# EAGLE schematic lcd_helloworld (EAGLE 7.0.0)
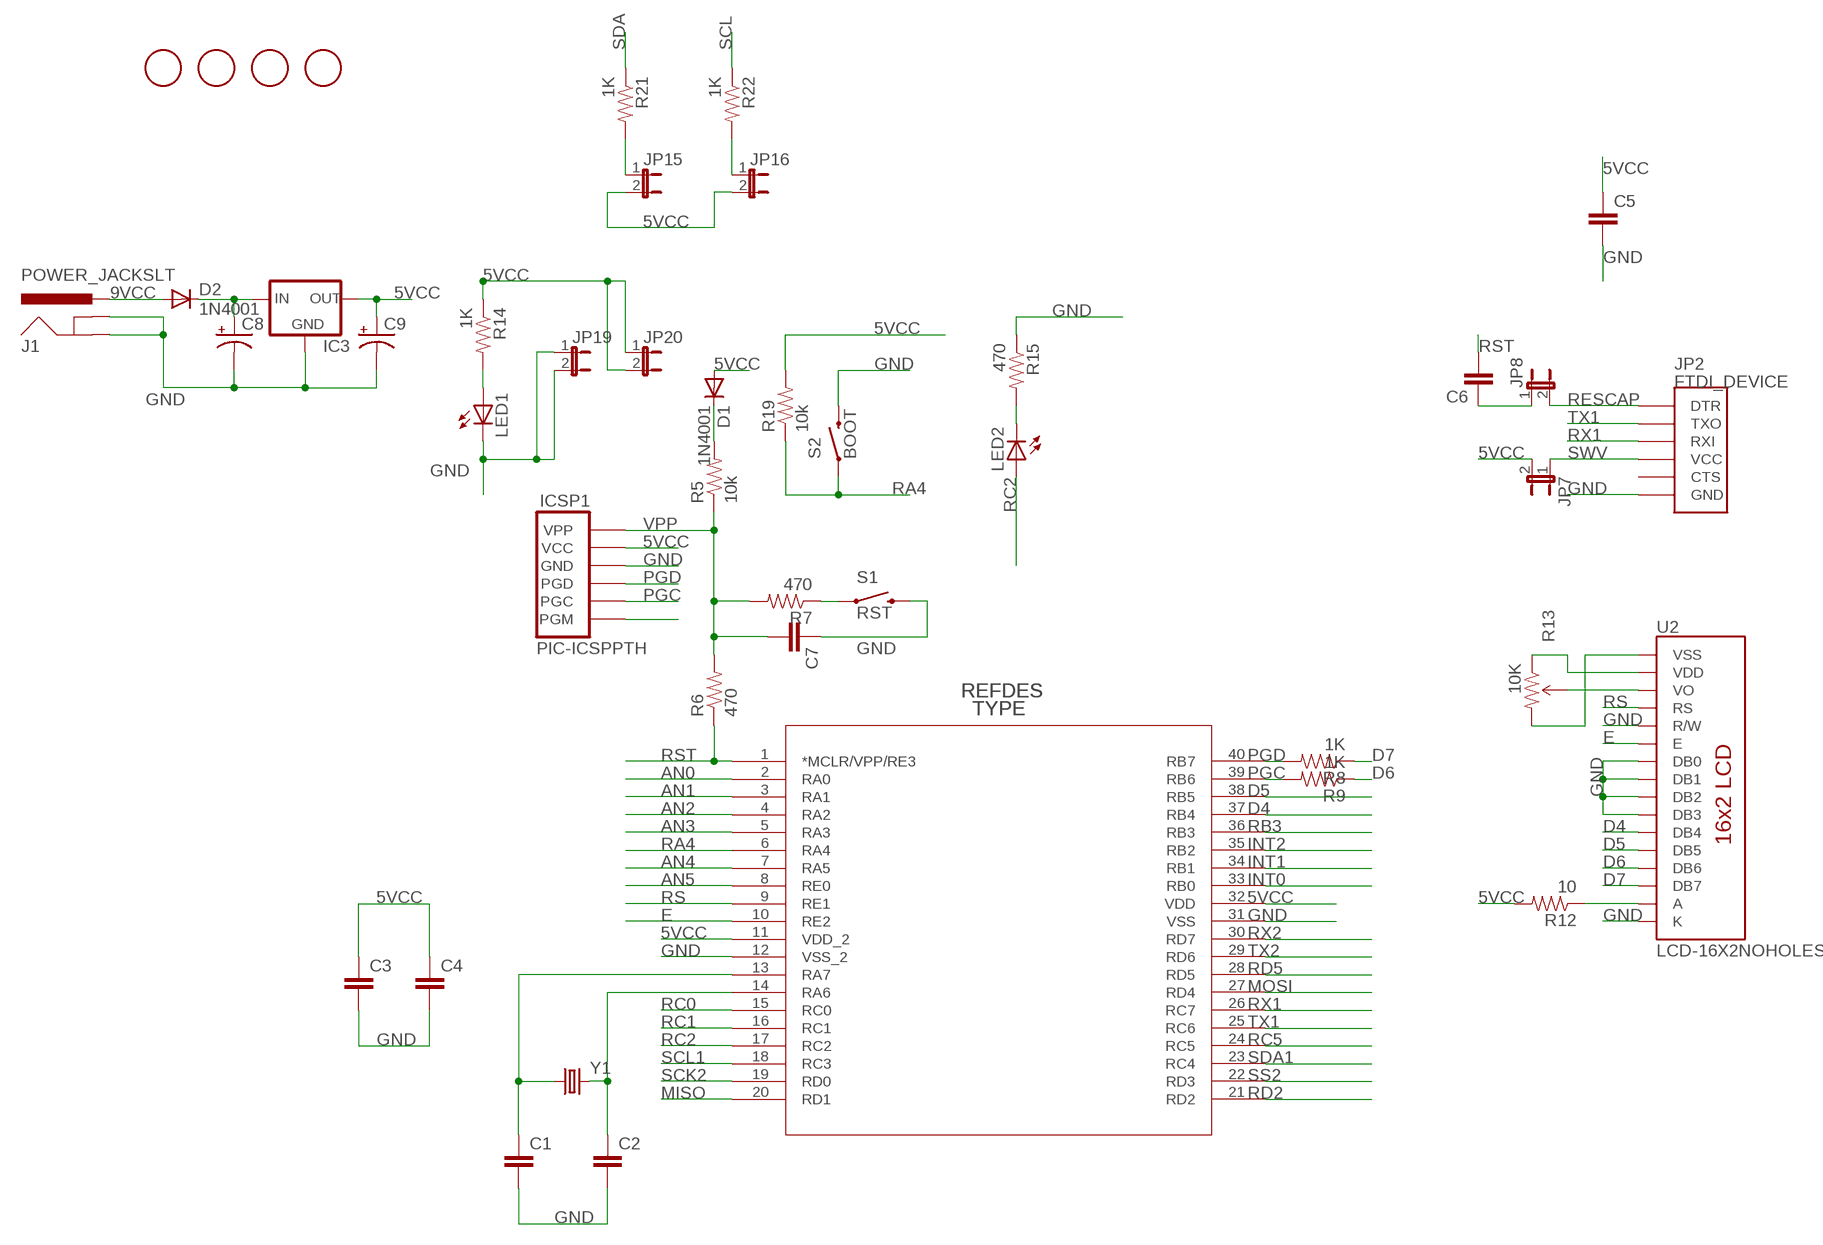
[diagram p0: schematic, sheet 1]

## Parts
C1  CAPPTH1  [CAP-PTH-5MM]
C2  CAPPTH1  [CAP-PTH-5MM]
C3  CAPPTH1  [CAP-PTH-5MM]
C4  CAPPTH1  [CAP-PTH-5MM]
C5  CAPPTH1  [CAP-PTH-5MM]
C6  CAPPTH1  [CAP-PTH-5MM]
C7  CAPPTH1  [CAP-PTH-5MM]
C8  CAP_POLPTH1  [CPOL-RADIAL-100UF-25V]
C9  CAP_POLPTH2  [CPOL-RADIAL-10UF-25V]
D1  1N4001  DIODEPTH  [DIODE-1N4001]
D2  1N4001  DIODEPTH  [DIODE-1N4001]
IC3  V_REG_78XXSINK  [TO220-IGO]
ICSP1  PIC-ICSPPTH  [MOLEX-1X6]
J1  POWER_JACKSLT  [POWER_JACK_SLOT]
JP2  FTDI_DEVICE  [FTDI_DEVICE_SIDE]
JP7  JUMPER-2PTH  [1X02]
JP8  JUMPER-2PTH  [1X02]
JP15  JUMPER-2PTH  [1X02]
JP16  JUMPER-2PTH  [1X02]
JP19  JUMPER-2PTH  [1X02]
JP20  JUMPER-2PTH  [1X02]
LED1  LED3MM  [LED3MM]
LED2  LED3MM  [LED3MM]
R5  10k  RESISTORAXIAL-0.3  [AXIAL-0.3]
R6  470  RESISTORAXIAL-0.3  [AXIAL-0.3]
R7  470  RESISTORAXIAL-0.3  [AXIAL-0.3]
R8  1K  RESISTORAXIAL-0.3  [AXIAL-0.3]
R9  1K  RESISTORAXIAL-0.3  [AXIAL-0.3]
R12  10  RESISTORAXIAL-0.3  [AXIAL-0.3]
R13  10K  TRIMPOTPTH  [TRIM_POT_PTH]
R14  1K  RESISTORAXIAL-0.3  [AXIAL-0.3]
R15  470  RESISTORAXIAL-0.3  [AXIAL-0.3]
R19  10k  RESISTORAXIAL-0.3  [AXIAL-0.3]
R21  1K  RESISTORAXIAL-0.3  [AXIAL-0.3]
R22  1K  RESISTORAXIAL-0.3  [AXIAL-0.3]
S1  RST  SWITCH-MOMENTARY-2PTH  [TACTILE-PTH]
S2  BOOT  SWITCH-MOMENTARY-2PTH  [TACTILE-PTH]
U1  PIC18F46K22  MICROCHIP_PIC18F46K22-X_P  [MICROCHIP_PDIP40_600MC]
U2  LCD-16X2NOHOLES  [LCD-16X2_NOHOLES]
U$1  MOUNTINGHOLE3.0THIN  [MOUNTINGHOLE_3.0_PLATEDTHIN]
U$2  MOUNTINGHOLE3.0THIN  [MOUNTINGHOLE_3.0_PLATEDTHIN]
U$3  MOUNTINGHOLE3.0THIN  [MOUNTINGHOLE_3.0_PLATEDTHIN]
U$4  MOUNTINGHOLE3.0THIN  [MOUNTINGHOLE_3.0_PLATEDTHIN]
Y1  CRYSTALHC49UV  [HC49U-V]

## Nets
5VCC: C3.1 C4.1 C5.1 C9.1(+) D1.A IC3.OUT ICSP1.5(VCC) JP7.2 JP15.2 JP16.2 JP20.1 JP20.2 R12.P$2 R13.1(CCW) R14.P$1 R19.P$2 U1.11(VDD_2) U1.32(VDD) U2.2(VDD)
9VCC: D2.A J1.PWR
AN0: U1.2(RA0)
AN1: U1.3(RA1)
AN2: U1.4(RA2)
AN3: U1.5(RA3)
AN4: U1.7(RA5)
AN5: U1.8(RE0)
D4: U1.37(RB4) U2.11(DB4)
D5: U1.38(RB5) U2.12(DB5)
D6: R9.P$1 U2.13(DB6)
D7: R8.P$1 U2.14(DB7)
E: U1.10(RE2) U2.6(E)
GND: C1.2 C2.2 C3.2 C4.2 C5.2 C7.1 C8.2(-) C9.2(-) IC3.GND ICSP1.4(GND) J1.GND@1(GNDBREAK) J1.GND@2(GND) JP2.P$6(GND) JP19.1 JP19.2 LED1.K(C) R13.3(CW) R15.P$1 S1.3 S2.3 U1.12(VSS_2) U1.31(VSS) U2.1(VSS) U2.5(R/W) U2.7(DB0) U2.8(DB1) U2.9(DB2) U2.10(DB3) U2.16(K)
INT0: U1.33(RB0)
INT1: U1.34(RB1)
INT2: U1.35(RB2)
MISO: U1.20(RD1)
MOSI: U1.27(RD4)
N$1: C1.1 U1.13(RA7) Y1.1
N$2: C2.1 U1.14(RA6) Y1.2
N$3: D1.C R5.P$2
N$4: R7.P$1 S1.1
N$7: C6.1 JP8.1
N$11: ICSP1.1(PGM)
N$17: C8.1(+) D2.C IC3.IN
N$18: R13.2(WIPER) U2.3(VO)
N$19: LED1.A R14.P$2
N$20: LED2.K(C) R15.P$2
N$25: R12.P$1 U2.15(A)
N$28: JP15.1 R21.P$2
N$31: JP16.1 R22.P$2
PGC: ICSP1.2(PGC) R9.P$2 U1.39(RB6)
PGD: ICSP1.3(PGD) R8.P$2 U1.40(RB7)
RA4: R19.P$1 S2.1 U1.6(RA4)
RB3: U1.36(RB3)
RC0: U1.15(RC0)
RC1: U1.16(RC1)
RC2: LED2.A U1.17(RC2)
RC5: U1.24(RC5)
RD2: U1.21(RD2)
RD5: U1.28(RD5)
RESCAP: JP2.P$1(DTR) JP8.2
RS: U1.9(RE1) U2.4(RS)
RST: C6.2 R6.P$1 U1.1(*MCLR/VPP/RE3)
RX1: JP2.P$3(RXI) U1.26(RC7)
RX2: U1.30(RD7)
SCK2: U1.19(RD0)
SCL: R22.P$1
SCL1: U1.18(RC3)
SDA: R21.P$1
SDA1: U1.23(RC4)
SS2: U1.22(RD3)
SWV: JP2.P$4(VCC) JP7.1
TX1: JP2.P$2(TXO) U1.25(RC6)
TX2: U1.29(RD6)
VPP: C7.2 ICSP1.6(VPP) R5.P$1 R6.P$2 R7.P$2
Unconnected: JP2.P$5(CTS)

## Library data of the parts
C1-C7 = SparkFun-Passives:CAP: Capacitor Standard 0603 ceramic capacitor, and 0.1" leaded capacitor.
C8 C9 = SparkFun-Capacitors:CAP_POL: Capacitor Polarized These are standard SMD and PTH capacitors. Normally 10uF, 47uF, and 100uF in electrolytic and tantalum varieties. Always verify the external diameter of the through hole cap, it varies with capacity, voltage, and manufacturer. The EIA devices should be standard.
D1 D2 = SparkFun-DiscreteSemi:DIODE: Diode These are standard reverse protection diodes and small signal diodes. SMA package can handle up to about 1A. SOD-323 can handle about 200mA. What the SOD-323 package when ordering, there are some mfgs out there that are 5-pin packages.
IC3 = SparkFun-PowerIC:V_REG_78XX: Voltage Regulator Standard 7805 5V regulator. IGO (Input Ground Output). Spark Fun Electronics SKU : COM-00107
ICSP1 = SparkFun-Connectors:PIC-ICSP: ISCP Programming connector for UAV, UBW Kit, etc.
J1 = SparkFun-Connectors:POWER_JACK: Power Jack This is the standard 5.5mm barrel jack for power. The PTH is the most common, proven, reliable, footprint. The Slot footprint only works if the mill layer is transmitted to the PCB fab house so be warned. Spark Fun Electronics SKU : PRT-00119 SMT: CONN-08106 Mating wall wart : TOL-00298 (and others)
JP2 = SparkFun-Connectors:FTDI_DEVICE: Connector which mates to FTDI basic or FTDI cable.
JP7 JP8 JP15 JP16 JP19 JP20 = SparkFun-Passives:JUMPER-2: Jumper Basic 0.1" spaced jumper. Use with breakaway headers.
LED1 LED2 = SparkFun-LED:LED: LEDs Standard schematic elements and footprints for 5mm, 3mm, 1206, and 0603 sized LEDs. 5mm - Spark Fun Electronics SKU : COM-00529 (and others)
R5 R19 = SparkFun-Resistors:RESISTOR: Resistor Basic schematic elements and footprints for 0603, 1206, and PTH resistors.
R6-R9 R12 R14 R15 R21 R22 = SparkFun-Passives:RESISTOR: Resistor Basic schematic elements and footprints for 0603, 1206, and PTH resistors.
R13 = SparkFun-Electromechanical:TRIMPOT: Various small potentiometers for "set-and-forget" applications
S1 S2 = SparkFun-Electromechanical:SWITCH-MOMENTARY-2: Various NO switches- pushbuttons, reed, etc
U1 = pic18f46k22_evb:MICROCHIP_PIC18F46K22-X_P
U2 = SparkFun-Displays:LCD-16X2: Standard text-only 16x2 parallel input LCD
U$1-U$4 = microbuilder:MOUNTINGHOLE: Mounting Hole
Y1 = SparkFun-FreqCtrl:CRYSTAL: Various standard crystals. Proven footprints. Spark Fun Electronics SKU : COM-00534